# EAGLE schematic BT_last_version (EAGLE 9.5.2)
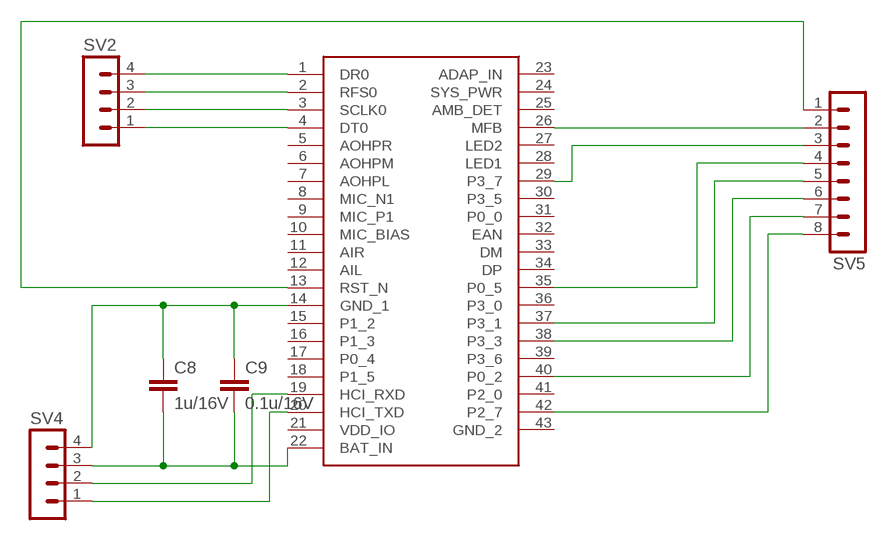
[diagram p0: schematic, sheet 1]

## Parts
ANT2  BM64SPKS1MC2-0001AA  [BM64SPKS1MC20001AA]
C8  1u/16V  C2,5-3  [C2.5-3]
C9  0.1u/16V  C2,5-3  [C2.5-3]
SV2  MA04-1  [MA04-1]
SV4  MA04-1  [MA04-1]
SV5  MA08-1W  [MA08-1W]

## Nets
N$1: ANT2.26(MFB) SV5.2
N$2: ANT2.29(P3_7) SV5.3
N$3: ANT2.35(P0_5) SV5.4
N$4: ANT2.37(P3_1) SV5.5
N$5: ANT2.38(P3_3) SV5.6
N$6: ANT2.2(RFS0) SV2.3
N$7: ANT2.3(SCLK0) SV2.2
N$10: ANT2.4(DT0) SV2.1
N$13: ANT2.1(DR0) SV2.4
N$18: ANT2.14(GND_1) C8.1 C9.1 SV4.4
N$20: ANT2.22(BAT_IN) C8.2 C9.2 SV4.3
N$21: ANT2.40(P0_2) SV5.7
N$22: ANT2.42(P2_7) SV5.8
N$23: ANT2.13(RST_N) SV5.1
N$24: ANT2.19(HCI_RXD) SV4.2
N$25: ANT2.20(HCI_TXD) SV4.1
Unconnected: ANT2.5(AOHPR) ANT2.6(AOHPM) ANT2.7(AOHPL) ANT2.8(MIC_N1) ANT2.9(MIC_P1) ANT2.10(MIC_BIAS) ANT2.11(AIR) ANT2.12(AIL) ANT2.15(P1_2) ANT2.16(P1_3) ANT2.17(P0_4) ANT2.18(P1_5) ANT2.21(VDD_IO) ANT2.23(ADAP_IN) ANT2.24(SYS_PWR) ANT2.25(AMB_DET) ANT2.27(LED2) ANT2.28(LED1) ANT2.30(P3_5) ANT2.31(P0_0) ANT2.32(EAN) ANT2.33(DM) ANT2.34(DP) ANT2.36(P3_0) ANT2.39(P3_6) ANT2.41(P2_0) ANT2.43(GND_2)

## Library data of the parts
ANT2 = BM64SPKS1MC2-0001AA:BM64SPKS1MC2-0001AA: BT4.2 Stereo Audio with BLE, I2S, Flash, Source: Datasheet <http://ww1.microchip.com/downloads/en/DeviceDoc/BM62-64-Bluetooth-Stereo-Audio-Module-Data-Sheet-DS60001403E.pdf> Check prices <https://pricing.snapeda.com/parts/BM64SPKS1MC2-0001AA/Microchip/view-part?ref=eda>; AVAILABILITY: Warning; DESCRIPTION: Bluetooth Bluetooth v5.0 Transceiver Module 2.4GHz Integrated, Trace Surface Mount; MF: Microchip; MP: BM64SPKS1MC2-0001AA; PACKAGE: Module Microchip; PRICE: None; PURCHASE-URL: https://pricing.snapeda.com/search/part/BM64SPKS1MC2-0001AA/?ref=eda
C8 C9 = capacitor-wima:C: CAPACITOR naming: grid - package width
SV2 SV4 = con-lstb:MA04-1: PIN HEADER; OC_FARNELL: unknown; OC_NEWARK: unknown
SV5 = con-lstb:MA08-1W: PIN HEADER; OC_FARNELL: unknown; OC_NEWARK: unknown